# Altium schematic sheet REAR_LOOM_BULKHEAD.SchDoc: =DocumentName
size 420 x 297 mm; Organization: Queen's Formula SAE; Address1: 130 Stuart St, Kingston; Address2: Ontario; Address3: Canada; Address4: K7L 2V9; DocumentNumber: 1; Revision: 0; SheetNumber: 1; SheetTotal: 1
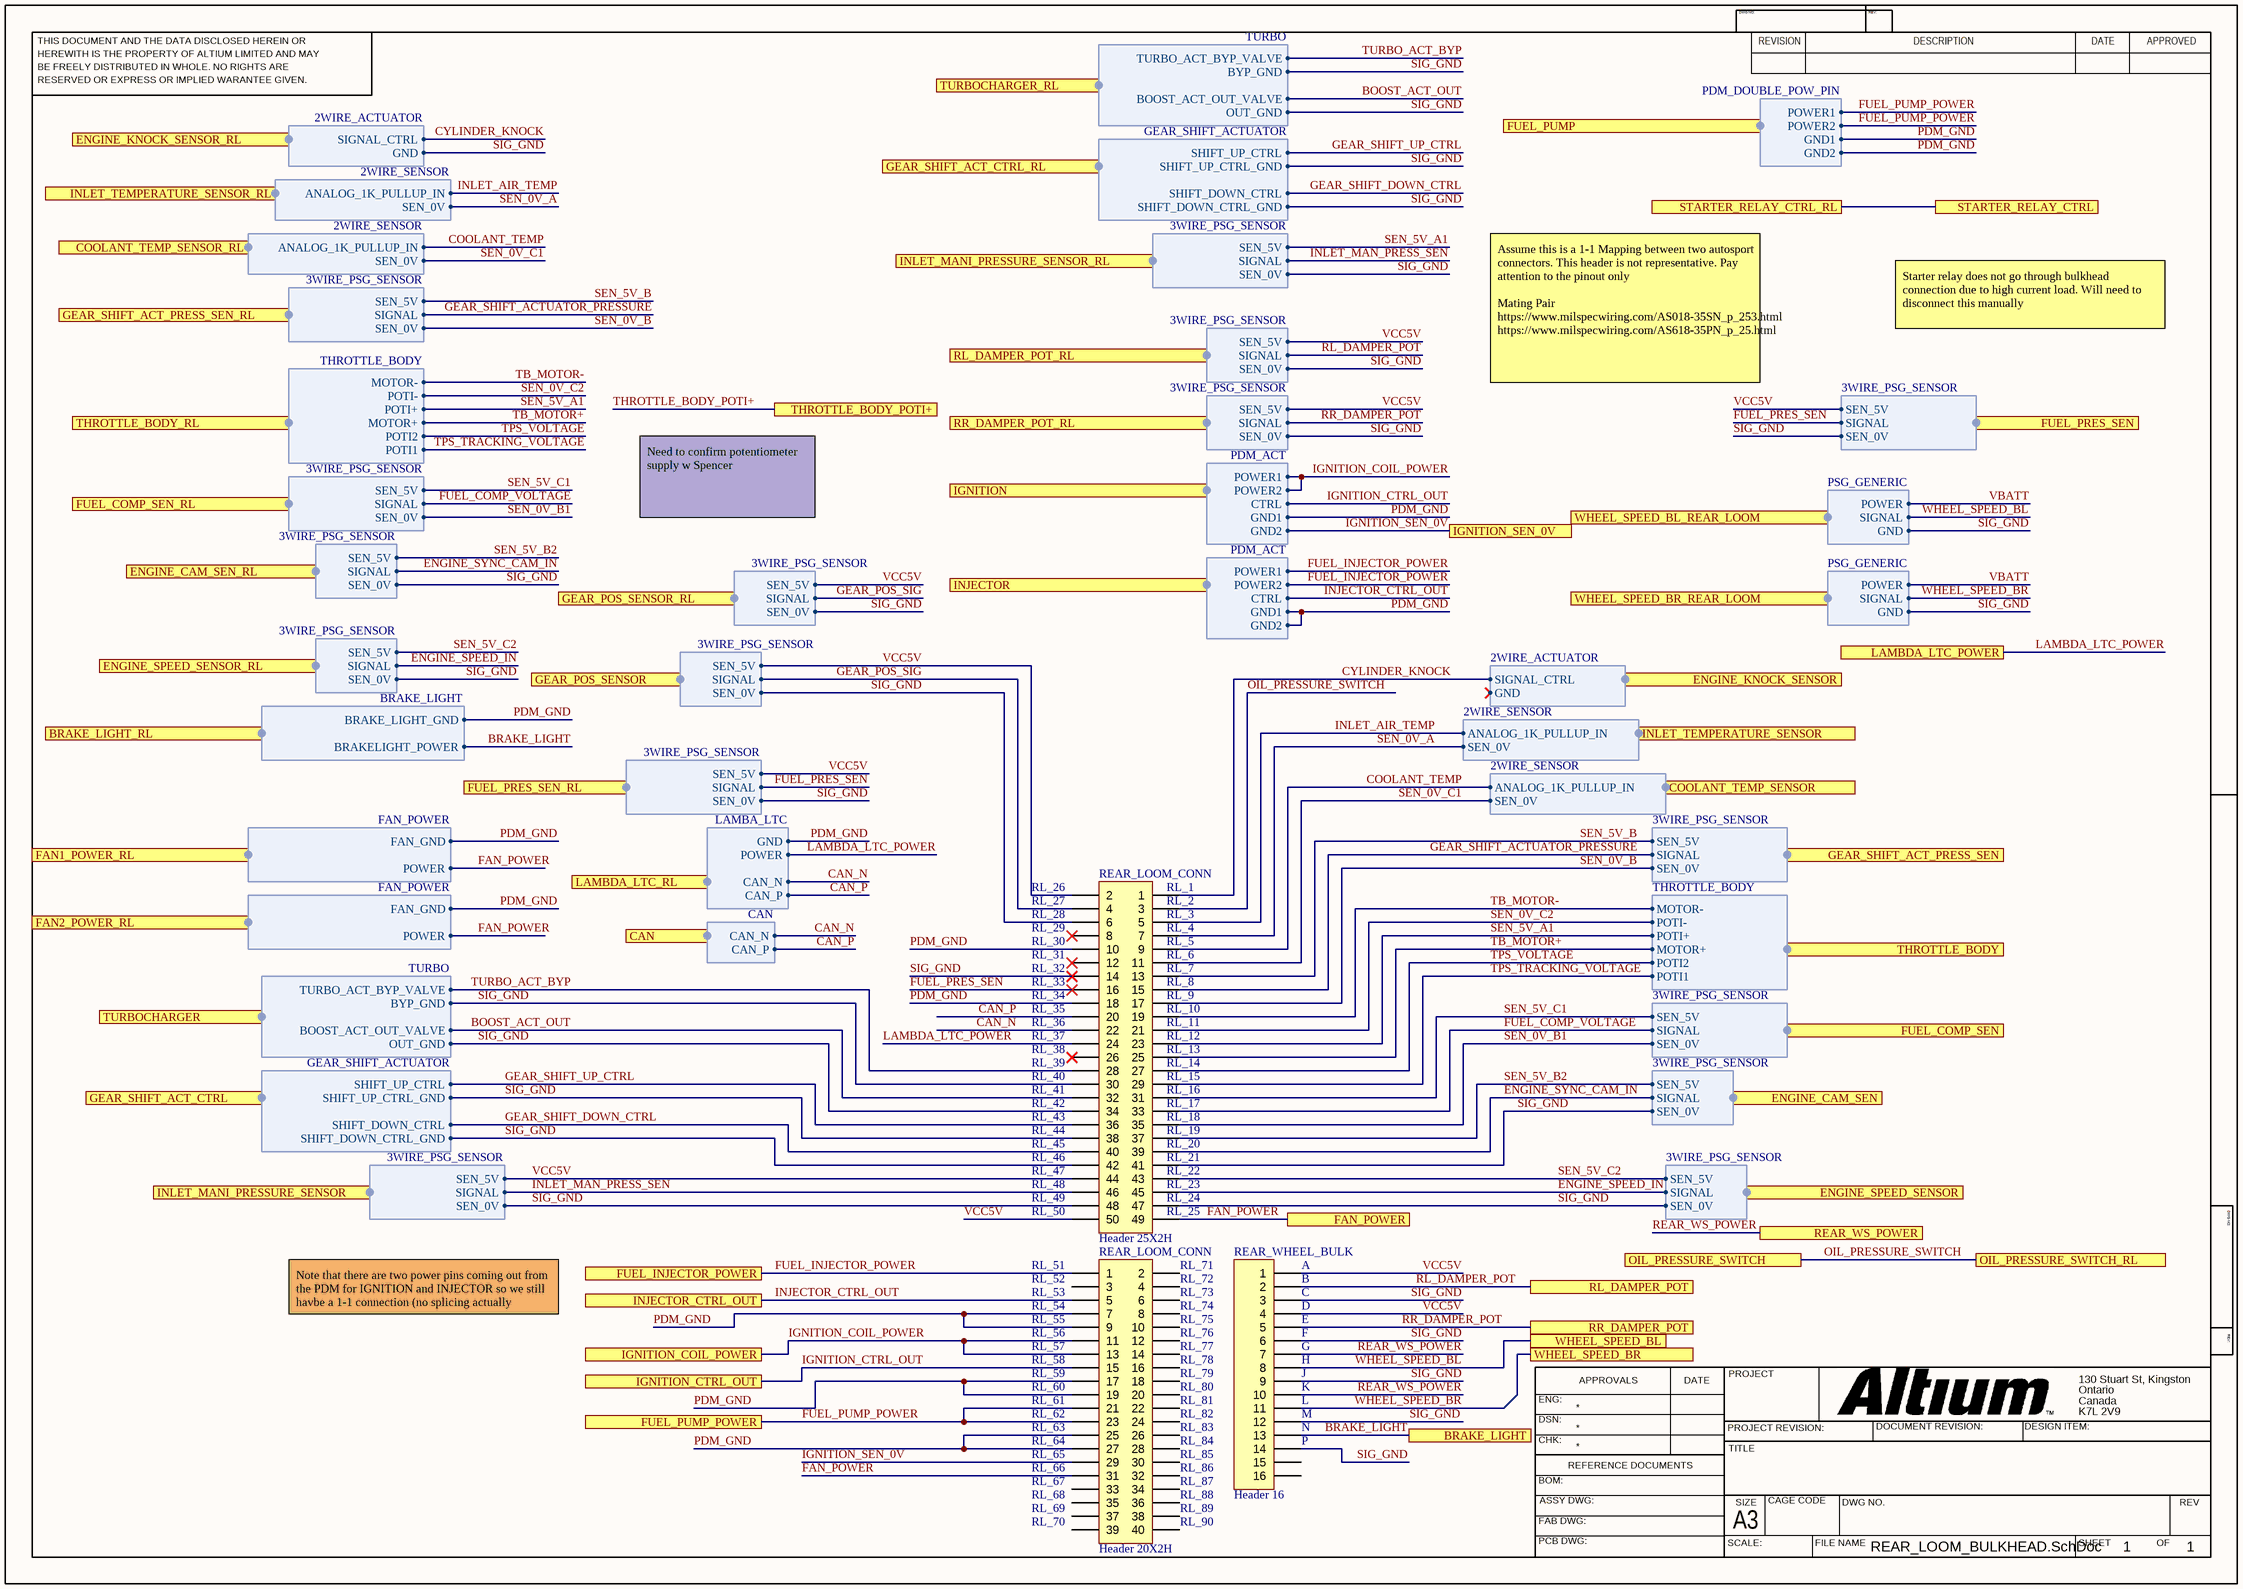
[diagram p0: REAR_LOOM_BULKHEAD.SchDoc]

## Parts
(Parts that share a designator on the sheet are numbered #1, #2 ... from top to bottom, then left to right.)
REAR_LOOM_CONN#1  Header 25X2H  [HDR2X25H]
REAR_LOOM_CONN#2  Header 20X2H  [HDR2X20H]
REAR_WHEEL_BULK  Header 16  [HDR1X16]

## Ports
BRAKE_LIGHT, BRAKE_LIGHT_RL (harness BRAKE_LIGHT), CAN (harness CAN), COOLANT_TEMP_SENSOR (harness 2WIRE_SENSOR), COOLANT_TEMP_SENSOR_RL (harness 2WIRE_SENSOR), ENGINE_CAM_SEN (harness 3WIRE_PSG_SENSOR), ENGINE_CAM_SEN_RL (harness 3WIRE_PSG_SENSOR), ENGINE_KNOCK_SENSOR (harness 2WIRE_ACTUATOR), ENGINE_KNOCK_SENSOR_RL (harness 2WIRE_ACTUATOR), ENGINE_SPEED_SENSOR (harness 3WIRE_PSG_SENSOR), ENGINE_SPEED_SENSOR_RL (harness 3WIRE_PSG_SENSOR), FAN1_POWER_RL (harness FAN_POWER), FAN2_POWER_RL (harness FAN_POWER), FAN_POWER, FUEL_COMP_SEN (harness 3WIRE_PSG_SENSOR), FUEL_COMP_SEN_RL (harness 3WIRE_PSG_SENSOR), FUEL_INJECTOR_POWER, FUEL_PRES_SEN (harness 3WIRE_PSG_SENSOR), FUEL_PRES_SEN_RL (harness 3WIRE_PSG_SENSOR), FUEL_PUMP (harness PDM_DOUBLE_POW_PIN), FUEL_PUMP_POWER, GEAR_POS_SENSOR (harness 3WIRE_PSG_SENSOR), GEAR_POS_SENSOR_RL (harness 3WIRE_PSG_SENSOR), GEAR_SHIFT_ACT_CTRL (harness GEAR_SHIFT_ACTUATOR), GEAR_SHIFT_ACT_CTRL_RL (harness GEAR_SHIFT_ACTUATOR), GEAR_SHIFT_ACT_PRESS_SEN (harness 3WIRE_PSG_SENSOR), GEAR_SHIFT_ACT_PRESS_SEN_RL (harness 3WIRE_PSG_SENSOR), IGNITION (harness PDM_ACT), IGNITION_COIL_POWER, IGNITION_CTRL_OUT, IGNITION_SEN_0V, INJECTOR (harness PDM_ACT), INJECTOR_CTRL_OUT, INLET_MANI_PRESSURE_SENSOR (harness 3WIRE_PSG_SENSOR), INLET_MANI_PRESSURE_SENSOR_RL (harness 3WIRE_PSG_SENSOR), INLET_TEMPERATURE_SENSOR (harness 2WIRE_SENSOR), INLET_TEMPERATURE_SENSOR_RL (harness 2WIRE_SENSOR), LAMBDA_LTC_POWER, LAMBDA_LTC_RL (harness LAMBA_LTC), OIL_PRESSURE_SWITCH, OIL_PRESSURE_SWITCH_RL, REAR_WS_POWER, RL_DAMPER_POT, RL_DAMPER_POT_RL (harness 3WIRE_PSG_SENSOR), RR_DAMPER_POT, RR_DAMPER_POT_RL (harness 3WIRE_PSG_SENSOR), STARTER_RELAY_CTRL, STARTER_RELAY_CTRL_RL, THROTTLE_BODY (harness THROTTLE_BODY), THROTTLE_BODY_POTI+, THROTTLE_BODY_RL (harness THROTTLE_BODY), TURBOCHARGER (harness TURBO), TURBOCHARGER_RL (harness TURBO), WHEEL_SPEED_BL, WHEEL_SPEED_BL_REAR_LOOM (harness PSG_GENERIC), WHEEL_SPEED_BR, WHEEL_SPEED_BR_REAR_LOOM (harness PSG_GENERIC)

## Harnesses
2WIRE_ACTUATOR: SIGNAL_CTRL, GND
GEAR_SHIFT_ACTUATOR: SHIFT_UP_CTRL, SHIFT_DOWN_CTRL, SHIFT_UP_CTRL_GND, SHIFT_DOWN_CTRL_GND
3WIRE_PSG_SENSOR: SEN_5V, SEN_0V, SIGNAL
TURBO: TURBO_ACT_BYP_VALVE, BOOST_ACT_OUT_VALVE, BYP_GND, OUT_GND
2WIRE_SENSOR: ANALOG_1K_PULLUP_IN, SEN_0V
THROTTLE_BODY: MOTOR+, MOTOR-, POTI1, POTI2, POTI-, POTI+
BRAKE_LIGHT: BRAKELIGHT_POWER, BRAKE_LIGHT_GND
PDM_ACT: POWER1, CTRL, GND1, GND2, POWER2
PDM_DOUBLE_POW_PIN: POWER1, GND1, GND2, POWER2
PSG_GENERIC: POWER, GND, SIGNAL
FAN_POWER: POWER, FAN_GND
CAN: CAN_P, CAN_N
LAMBA_LTC: CAN_P, CAN_N, POWER, GND

## Nets
BOOST_ACT_OUT: REAR_LOOM_CONN#1.32 ; port TURBOCHARGER.BOOST_ACT_OUT_VALVE, port TURBOCHARGER_RL.BOOST_ACT_OUT_VALVE
BRAKE_LIGHT: REAR_WHEEL_BULK.13 ; port BRAKE_LIGHT, port BRAKE_LIGHT_RL.BRAKELIGHT_POWER
CAN_N: REAR_LOOM_CONN#1.22 ; port CAN.CAN_N, port LAMBDA_LTC_RL.CAN_N
CAN_P: REAR_LOOM_CONN#1.20 ; port CAN.CAN_P, port LAMBDA_LTC_RL.CAN_P
COOLANT_TEMP: REAR_LOOM_CONN#1.9 ; port COOLANT_TEMP_SENSOR.ANALOG_1K_PULLUP_IN, port COOLANT_TEMP_SENSOR_RL.ANALOG_1K_PULLUP_IN
CYLINDER_KNOCK: REAR_LOOM_CONN#1.1 ; port ENGINE_KNOCK_SENSOR.SIGNAL_CTRL, port ENGINE_KNOCK_SENSOR_RL.SIGNAL_CTRL
ENGINE_SPEED_IN: REAR_LOOM_CONN#1.45 ; port ENGINE_SPEED_SENSOR.SIGNAL, port ENGINE_SPEED_SENSOR_RL.SIGNAL
ENGINE_SYNC_CAM_IN: REAR_LOOM_CONN#1.39 ; port ENGINE_CAM_SEN.SIGNAL, port ENGINE_CAM_SEN_RL.SIGNAL
FAN_POWER: REAR_LOOM_CONN#1.49 REAR_LOOM_CONN#2.31 ; port FAN_POWER, port FAN1_POWER_RL.POWER, port FAN2_POWER_RL.POWER
FUEL_COMP_VOLTAGE: REAR_LOOM_CONN#1.33 ; port FUEL_COMP_SEN.SIGNAL, port FUEL_COMP_SEN_RL.SIGNAL
FUEL_INJECTOR_POWER: REAR_LOOM_CONN#2.1 ; port FUEL_INJECTOR_POWER, port INJECTOR.POWER1, port INJECTOR.POWER2
FUEL_PRES_SEN: REAR_LOOM_CONN#1.16 ; port FUEL_PRES_SEN.SIGNAL, port FUEL_PRES_SEN_RL.SIGNAL
FUEL_PUMP_POWER: REAR_LOOM_CONN#2.21 REAR_LOOM_CONN#2.23 ; port FUEL_PUMP_POWER, port FUEL_PUMP.POWER1, port FUEL_PUMP.POWER2
GEAR_POS_SIG: REAR_LOOM_CONN#1.4 ; port GEAR_POS_SENSOR.SIGNAL, port GEAR_POS_SENSOR_RL.SIGNAL
GEAR_SHIFT_ACTUATOR_PRESSURE: REAR_LOOM_CONN#1.15 ; port GEAR_SHIFT_ACT_PRESS_SEN.SIGNAL, port GEAR_SHIFT_ACT_PRESS_SEN_RL.SIGNAL
GEAR_SHIFT_DOWN_CTRL: REAR_LOOM_CONN#1.40 ; port GEAR_SHIFT_ACT_CTRL.SHIFT_DOWN_CTRL, port GEAR_SHIFT_ACT_CTRL_RL.SHIFT_DOWN_CTRL
GEAR_SHIFT_UP_CTRL: REAR_LOOM_CONN#1.36 ; port GEAR_SHIFT_ACT_CTRL.SHIFT_UP_CTRL, port GEAR_SHIFT_ACT_CTRL_RL.SHIFT_UP_CTRL
IGNITION_COIL_POWER: REAR_LOOM_CONN#2.11 REAR_LOOM_CONN#2.13 ; port IGNITION_COIL_POWER, port IGNITION.POWER1, port IGNITION.POWER2
IGNITION_CTRL_OUT: REAR_LOOM_CONN#2.15 ; port IGNITION_CTRL_OUT, port IGNITION.CTRL
IGNITION_SEN_0V: REAR_LOOM_CONN#2.29 ; port IGNITION_SEN_0V, port IGNITION.GND2
INJECTOR_CTRL_OUT: REAR_LOOM_CONN#2.5 ; port INJECTOR_CTRL_OUT, port INJECTOR.CTRL
INLET_AIR_TEMP: REAR_LOOM_CONN#1.5 ; port INLET_TEMPERATURE_SENSOR.ANALOG_1K_PULLUP_IN, port INLET_TEMPERATURE_SENSOR_RL.ANALOG_1K_PULLUP_IN
INLET_MAN_PRESS_SEN: REAR_LOOM_CONN#1.46 ; port INLET_MANI_PRESSURE_SENSOR.SIGNAL, port INLET_MANI_PRESSURE_SENSOR_RL.SIGNAL
LAMBDA_LTC_POWER: REAR_LOOM_CONN#1.24 ; port LAMBDA_LTC_POWER, port LAMBDA_LTC_RL.POWER
OIL_PRESSURE_SWITCH: REAR_LOOM_CONN#1.3 ; port OIL_PRESSURE_SWITCH, port OIL_PRESSURE_SWITCH_RL
PDM_GND: REAR_LOOM_CONN#1.10 REAR_LOOM_CONN#1.18 REAR_LOOM_CONN#2.7 REAR_LOOM_CONN#2.9 REAR_LOOM_CONN#2.17 REAR_LOOM_CONN#2.19 REAR_LOOM_CONN#2.25 REAR_LOOM_CONN#2.27 ; port BRAKE_LIGHT_RL.BRAKE_LIGHT_GND, port INJECTOR.GND1, port INJECTOR.GND2, port IGNITION.GND1, port FUEL_PUMP.GND1, port FUEL_PUMP.GND2, port FAN1_POWER_RL.FAN_GND, port FAN2_POWER_RL.FAN_GND, port LAMBDA_LTC_RL.GND
REAR_WS_POWER: REAR_WHEEL_BULK.7 REAR_WHEEL_BULK.10 ; port REAR_WS_POWER
RL_DAMPER_POT: REAR_WHEEL_BULK.2 ; port RL_DAMPER_POT, port RL_DAMPER_POT_RL.SIGNAL
RR_DAMPER_POT: REAR_WHEEL_BULK.5 ; port RR_DAMPER_POT, port RR_DAMPER_POT_RL.SIGNAL
SEN_0V_A: REAR_LOOM_CONN#1.7 ; port INLET_TEMPERATURE_SENSOR.SEN_0V, port INLET_TEMPERATURE_SENSOR_RL.SEN_0V
SEN_0V_B: REAR_LOOM_CONN#1.17 ; port GEAR_SHIFT_ACT_PRESS_SEN.SEN_0V, port GEAR_SHIFT_ACT_PRESS_SEN_RL.SEN_0V
SEN_0V_B1: REAR_LOOM_CONN#1.35 ; port FUEL_COMP_SEN.SEN_0V, port FUEL_COMP_SEN_RL.SEN_0V
SEN_0V_C1: REAR_LOOM_CONN#1.11 ; port COOLANT_TEMP_SENSOR.SEN_0V, port COOLANT_TEMP_SENSOR_RL.SEN_0V
SEN_0V_C2: REAR_LOOM_CONN#1.21 ; port THROTTLE_BODY.POTI-, port THROTTLE_BODY_RL.POTI-
SEN_5V_A1: REAR_LOOM_CONN#1.23 ; port THROTTLE_BODY.POTI+, port THROTTLE_BODY_RL.POTI+, port INLET_MANI_PRESSURE_SENSOR_RL.SEN_5V
SEN_5V_B: REAR_LOOM_CONN#1.13 ; port GEAR_SHIFT_ACT_PRESS_SEN.SEN_5V, port GEAR_SHIFT_ACT_PRESS_SEN_RL.SEN_5V
SEN_5V_B2: REAR_LOOM_CONN#1.37 ; port ENGINE_CAM_SEN.SEN_5V, port ENGINE_CAM_SEN_RL.SEN_5V
SEN_5V_C1: REAR_LOOM_CONN#1.31 ; port FUEL_COMP_SEN.SEN_5V, port FUEL_COMP_SEN_RL.SEN_5V
SEN_5V_C2: REAR_LOOM_CONN#1.43 ; port ENGINE_SPEED_SENSOR.SEN_5V, port ENGINE_SPEED_SENSOR_RL.SEN_5V
SIG_GND: REAR_LOOM_CONN#1.6 REAR_LOOM_CONN#1.14 REAR_LOOM_CONN#1.30 REAR_LOOM_CONN#1.34 REAR_LOOM_CONN#1.38 REAR_LOOM_CONN#1.41 REAR_LOOM_CONN#1.42 REAR_LOOM_CONN#1.47 REAR_LOOM_CONN#1.48 REAR_WHEEL_BULK.3 REAR_WHEEL_BULK.6 REAR_WHEEL_BULK.9 REAR_WHEEL_BULK.12 REAR_WHEEL_BULK.14 ; port GEAR_SHIFT_ACT_CTRL.SHIFT_UP_CTRL_GND, port GEAR_SHIFT_ACT_CTRL.SHIFT_DOWN_CTRL_GND, port ENGINE_SPEED_SENSOR.SEN_0V, port ENGINE_CAM_SEN.SEN_0V, port INLET_MANI_PRESSURE_SENSOR.SEN_0V, port TURBOCHARGER.BYP_GND, port TURBOCHARGER.OUT_GND, port ENGINE_KNOCK_SENSOR_RL.GND, port ENGINE_SPEED_SENSOR_RL.SEN_0V, port ENGINE_CAM_SEN_RL.SEN_0V, port GEAR_SHIFT_ACT_CTRL_RL.SHIFT_UP_CTRL_GND, port GEAR_SHIFT_ACT_CTRL_RL.SHIFT_DOWN_CTRL_GND, port INLET_MANI_PRESSURE_SENSOR_RL.SEN_0V, port TURBOCHARGER_RL.BYP_GND, port TURBOCHARGER_RL.OUT_GND, port RL_DAMPER_POT_RL.SEN_0V, port RR_DAMPER_POT_RL.SEN_0V, port WHEEL_SPEED_BL_REAR_LOOM.GND, port WHEEL_SPEED_BR_REAR_LOOM.GND, port GEAR_POS_SENSOR.SEN_0V, port GEAR_POS_SENSOR_RL.SEN_0V, port FUEL_PRES_SEN.SEN_0V, port FUEL_PRES_SEN_RL.SEN_0V
STARTER_RELAY_CTRL: port STARTER_RELAY_CTRL, port STARTER_RELAY_CTRL_RL
TB_MOTOR+: REAR_LOOM_CONN#1.25 ; port THROTTLE_BODY.MOTOR+, port THROTTLE_BODY_RL.MOTOR+
TB_MOTOR-: REAR_LOOM_CONN#1.19 ; port THROTTLE_BODY.MOTOR-, port THROTTLE_BODY_RL.MOTOR-
THROTTLE_BODY_POTI+: port THROTTLE_BODY_POTI+
TPS_TRACKING_VOLTAGE: REAR_LOOM_CONN#1.29 ; port THROTTLE_BODY.POTI1, port THROTTLE_BODY_RL.POTI1
TPS_VOLTAGE: REAR_LOOM_CONN#1.27 ; port THROTTLE_BODY.POTI2, port THROTTLE_BODY_RL.POTI2
TURBO_ACT_BYP: REAR_LOOM_CONN#1.28 ; port TURBOCHARGER.TURBO_ACT_BYP_VALVE, port TURBOCHARGER_RL.TURBO_ACT_BYP_VALVE
VBATT: port WHEEL_SPEED_BL_REAR_LOOM.POWER, port WHEEL_SPEED_BR_REAR_LOOM.POWER
VCC5V: REAR_LOOM_CONN#1.2 REAR_LOOM_CONN#1.44 REAR_LOOM_CONN#1.50 REAR_WHEEL_BULK.1 REAR_WHEEL_BULK.4 ; port INLET_MANI_PRESSURE_SENSOR.SEN_5V, port RL_DAMPER_POT_RL.SEN_5V, port RR_DAMPER_POT_RL.SEN_5V, port GEAR_POS_SENSOR.SEN_5V, port GEAR_POS_SENSOR_RL.SEN_5V, port FUEL_PRES_SEN.SEN_5V, port FUEL_PRES_SEN_RL.SEN_5V
WHEEL_SPEED_BL: REAR_WHEEL_BULK.8 ; port WHEEL_SPEED_BL, port WHEEL_SPEED_BL_REAR_LOOM.SIGNAL
WHEEL_SPEED_BR: REAR_WHEEL_BULK.11 ; port WHEEL_SPEED_BR, port WHEEL_SPEED_BR_REAR_LOOM.SIGNAL

Not connected (* = marked no-connect by the designer): REAR_LOOM_CONN#1 8* 12* 26*; REAR_LOOM_CONN#2 2 3 4 6 8 10 12 14 16 18 20 22 24 26 28 30 32 33 34 35 36 37 38 39 40; REAR_WHEEL_BULK 15 16

## Notes on the sheet
- Starter relay does not go through bulkhead connection due to high current load. Will need to disconnect this manually
- Assume this is a 1-1 Mapping between two autosport connectors. This header is not representative. Pay attention to the pinout only
  Mating Pair
  https://www.milspecwiring.com/AS018-35SN_p_253.html
  https://www.milspecwiring.com/AS618-35PN_p_25.html
- Need to confirm potentiometer supply w Spencer
- (near REAR_LOOM_CONN#1) RL_26
- (near REAR_LOOM_CONN#1) RL_27
- (near REAR_LOOM_CONN#1) RL_28
- (near REAR_LOOM_CONN#1) RL_29
- (near REAR_LOOM_CONN#1) RL_1
- (near REAR_LOOM_CONN#1) RL_2
- (near REAR_LOOM_CONN#1) RL_3
- (near REAR_LOOM_CONN#1) RL_4
- (near REAR_LOOM_CONN#1) RL_30
- (near REAR_LOOM_CONN#1) RL_31
- (near REAR_LOOM_CONN#1) RL_32
- (near REAR_LOOM_CONN#1) RL_33
- (near REAR_LOOM_CONN#1) RL_34
- (near REAR_LOOM_CONN#1) RL_5
- (near REAR_LOOM_CONN#1) RL_6
- (near REAR_LOOM_CONN#1) RL_7
- (near REAR_LOOM_CONN#1) RL_8
- (near REAR_LOOM_CONN#1) RL_9
- (near REAR_LOOM_CONN#1) RL_35
- (near REAR_LOOM_CONN#1) RL_36
- (near REAR_LOOM_CONN#1) RL_37
- (near REAR_LOOM_CONN#1) RL_38
- (near REAR_LOOM_CONN#1) RL_39
- (near REAR_LOOM_CONN#1) RL_10
- (near REAR_LOOM_CONN#1) RL_11
- (near REAR_LOOM_CONN#1) RL_12
- (near REAR_LOOM_CONN#1) RL_13
- (near REAR_LOOM_CONN#1) RL_14
- (near REAR_LOOM_CONN#1) RL_40
- (near REAR_LOOM_CONN#1) RL_41
- (near REAR_LOOM_CONN#1) RL_42
- (near REAR_LOOM_CONN#1) RL_43
- (near REAR_LOOM_CONN#1) RL_44
- (near REAR_LOOM_CONN#1) RL_15
- (near REAR_LOOM_CONN#1) RL_16
- (near REAR_LOOM_CONN#1) RL_17
- (near REAR_LOOM_CONN#1) RL_18
- (near REAR_LOOM_CONN#1) RL_19
- (near REAR_LOOM_CONN#1) RL_45
- (near REAR_LOOM_CONN#1) RL_46
- (near REAR_LOOM_CONN#1) RL_47
- (near REAR_LOOM_CONN#1) RL_48
- (near REAR_LOOM_CONN#1) RL_49
- (near REAR_LOOM_CONN#1) RL_20
- (near REAR_LOOM_CONN#1) RL_21
- (near REAR_LOOM_CONN#1) RL_22
- (near REAR_LOOM_CONN#1) RL_23
- (near REAR_LOOM_CONN#1) RL_24
- (near REAR_LOOM_CONN#1) RL_50
- (near REAR_LOOM_CONN#2) RL_51
- (near REAR_LOOM_CONN#1) RL_25
- (near REAR_LOOM_CONN#2) RL_71
- (near REAR_WHEEL_BULK) A
- Note that there are two power pins coming out from the PDM for IGNITION and INJECTOR so we still havbe a 1-1 connection (no splicing actually needed)
- (near REAR_LOOM_CONN#2) RL_52
- (near REAR_LOOM_CONN#2) RL_53
- (near REAR_LOOM_CONN#2) RL_54
- (near REAR_LOOM_CONN#2) RL_55
- (near REAR_LOOM_CONN#2) RL_56
- (near REAR_LOOM_CONN#2) RL_72
- (near REAR_LOOM_CONN#2) RL_73
- (near REAR_LOOM_CONN#2) RL_74
- (near REAR_LOOM_CONN#2) RL_75
- (near REAR_LOOM_CONN#2) RL_76
- (near REAR_WHEEL_BULK) B
- (near REAR_WHEEL_BULK) C
- (near REAR_WHEEL_BULK) D
- (near REAR_WHEEL_BULK) E
- (near REAR_WHEEL_BULK) F
- (near REAR_LOOM_CONN#2) RL_57
- (near REAR_LOOM_CONN#2) RL_58
- (near REAR_LOOM_CONN#2) RL_59
- (near REAR_LOOM_CONN#2) RL_60
- (near REAR_LOOM_CONN#2) RL_61
- (near REAR_LOOM_CONN#2) RL_77
- (near REAR_LOOM_CONN#2) RL_78
- (near REAR_LOOM_CONN#2) RL_79
- (near REAR_LOOM_CONN#2) RL_80
- (near REAR_LOOM_CONN#2) RL_81
- (near REAR_WHEEL_BULK) G
- (near REAR_WHEEL_BULK) H
- (near REAR_WHEEL_BULK) J
- (near REAR_WHEEL_BULK) K
- (near REAR_WHEEL_BULK) L
- (near REAR_LOOM_CONN#2) RL_62
- (near REAR_LOOM_CONN#2) RL_63
- (near REAR_LOOM_CONN#2) RL_64
- (near REAR_LOOM_CONN#2) RL_65
- (near REAR_LOOM_CONN#2) RL_66
- (near REAR_LOOM_CONN#2) RL_82
- (near REAR_LOOM_CONN#2) RL_83
- (near REAR_LOOM_CONN#2) RL_84
- (near REAR_LOOM_CONN#2) RL_85
- (near REAR_LOOM_CONN#2) RL_86
- (near REAR_WHEEL_BULK) M
- (near REAR_WHEEL_BULK) N
- (near REAR_WHEEL_BULK) P
- (near REAR_LOOM_CONN#2) RL_67
- (near REAR_LOOM_CONN#2) RL_68
- (near REAR_LOOM_CONN#2) RL_69
- (near REAR_LOOM_CONN#2) RL_70
- (near REAR_LOOM_CONN#2) RL_87
- (near REAR_LOOM_CONN#2) RL_88
- (near REAR_LOOM_CONN#2) RL_89
- (near REAR_LOOM_CONN#2) RL_90
- THIS DOCUMENT AND THE DATA DISCLOSED HEREIN OR
- HEREWITH IS THE PROPERTY OF ALTIUM LIMITED AND MAY
- DWG NO:
- REVISION
- REV:
- DESCRIPTION
- DATE
- APPROVED
- BE FREELY DISTRIBUTED IN WHOLE. NO RIGHTS ARE
- RESERVED OR EXPRESS OR IMPLIED WARANTEE GIVEN.
- ENG:
- APPROVALS
- PROJECT
- DSN:
- CHK:
- REFERENCE DOCUMENTS
- PROJECT REVISION:
- TITLE
- DOCUMENT REVISION:
- DESIGN ITEM:
- BOM:
- FAB DWG:
- PCB DWG:
- ASSY DWG:
- SCALE:
- A3
- SIZE
- CAGE CODE
- FILE NAME
- DWG NO.
- SHEET
- OF
- REV

## Library data of the parts
REAR_LOOM_CONN#1 = Header 25X2H: Header, 25-Pin, Dual row, Right Angle; LatestRevisionDate: 17-Jul-2002; LatestRevisionNote: Re-released for DXP Platform.; Publisher: Altium Limited
REAR_LOOM_CONN#2 = Header 20X2H: Header, 20-Pin, Dual row, Right Angle; LatestRevisionDate: 17-Jul-2002; LatestRevisionNote: Re-released for DXP Platform.; Publisher: Altium Limited
REAR_WHEEL_BULK = Header 16: Header, 16-Pin; LatestRevisionDate: 17-Jul-2002; LatestRevisionNote: Re-released for DXP Platform.; Publisher: Altium Limited